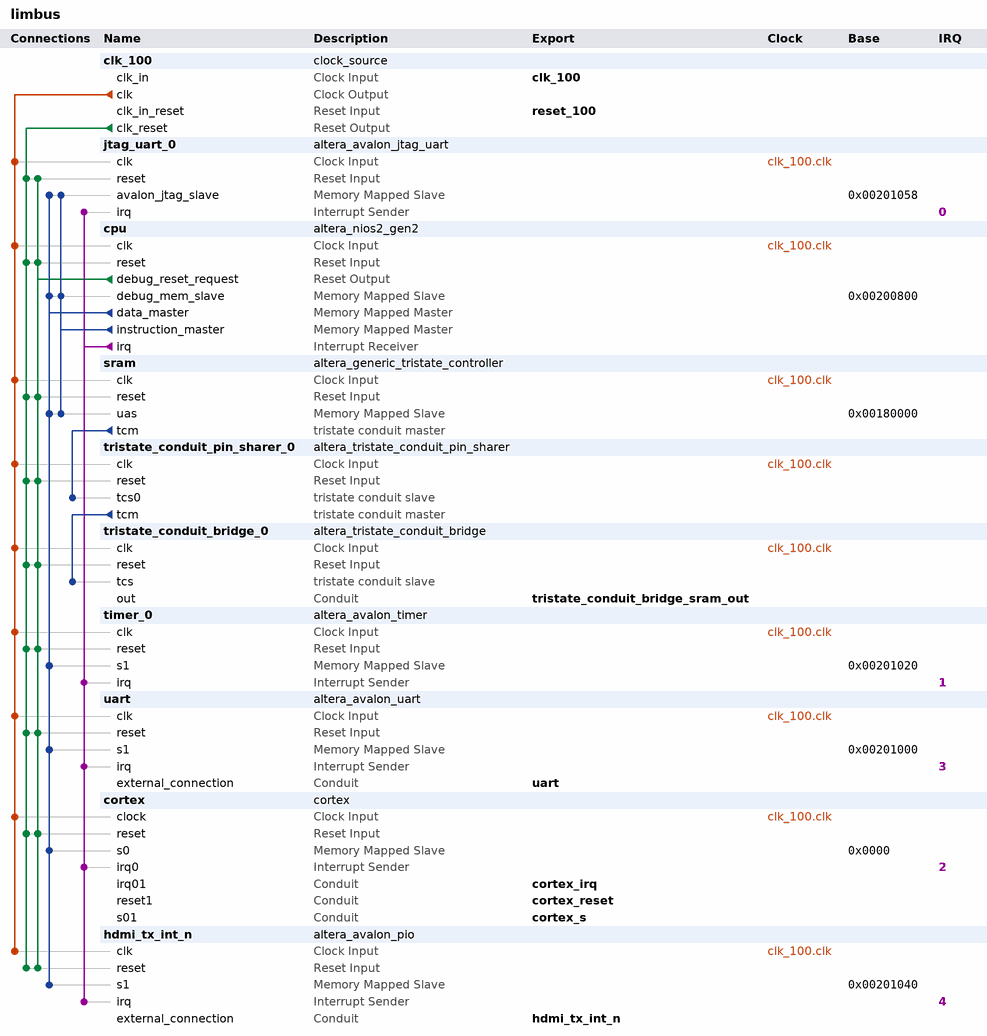
[diagram p0: system contents]
# Platform Designer (Qsys) system limbus, Cyclone V 5CGXFC5C6F27C7
# Parameters at their usual value, and those the tool derives, are not listed.
package require -exact qsys 15.1
create_system limbus
set_project_property DEVICE_FAMILY {Cyclone V}
set_project_property DEVICE 5CGXFC5C6F27C7

add_instance clk_100 clock_source 15.1
set_instance_parameter_value clk_100 clockFrequency 100000000

add_instance jtag_uart_0 altera_avalon_jtag_uart 15.1
set_instance_parameter_value jtag_uart_0 simInteractiveOptions NO_INTERACTIVE_WINDOWS

add_instance cpu altera_nios2_gen2 15.1
set_instance_parameter_value cpu dcache_size 2048
set_instance_parameter_value cpu exceptionSlave sram.uas
set_instance_parameter_value cpu icache_size 4096
set_instance_parameter_value cpu impl Tiny
set_instance_parameter_value cpu resetSlave sram.uas
set_instance_parameter_value cpu setting_activateTrace true

add_instance sram altera_generic_tristate_controller 15.1
set_instance_parameter_value sram ACTIVE_LOW_BEGINTRANSFER 0
set_instance_parameter_value sram ACTIVE_LOW_BYTEENABLE 1
set_instance_parameter_value sram ACTIVE_LOW_OUTPUTENABLE 1
set_instance_parameter_value sram ACTIVE_LOW_READ 0
set_instance_parameter_value sram CHIPSELECT_THROUGH_READLATENCY 0
set_instance_parameter_value sram INTERFACE_ASSIGNMENT_KEYS embeddedsw.configuration.isMemoryDevice
set_instance_parameter_value sram INTERFACE_ASSIGNMENT_VALUES 1
set_instance_parameter_value sram MODULE_ASSIGNMENT_KEYS embeddedsw.configuration.hwClassnameDriverSupportList,embeddedsw.CMacro.SRAM_MEMORY_SIZE,embeddedsw.CMacro.SRAM_MEMORY_UNITS,embeddedsw.CMacro.SRAM_DATA_WIDTH,embeddedsw.memoryInfo.MEM_INIT_DATA_WIDTH,embeddedsw.memoryInfo.HAS_BYTE_LANE,embeddedsw.memoryInfo.GENERATE_DAT_SYM,embeddedsw.memoryInfo.DAT_SYM_INSTALL_DIR,embeddedsw.CMacro.SIZE
set_instance_parameter_value sram MODULE_ASSIGNMENT_VALUES "altera_avalon_lan91c111\\,altera_avalon_cfi_flash,524288,1,16,16,1,1,SIM_DIR,524288"
set_instance_parameter_value sram TCM_ADDRESS_W 19
set_instance_parameter_value sram TCM_BYTEENABLE_W 2
set_instance_parameter_value sram TCM_DATA_HOLD 10
set_instance_parameter_value sram TCM_DATA_W 16
set_instance_parameter_value sram TCM_MAX_PENDING_READ_TRANSACTIONS 3
set_instance_parameter_value sram TCM_READLATENCY 2
set_instance_parameter_value sram TCM_READ_WAIT 10
set_instance_parameter_value sram TCM_SETUP_WAIT 10
set_instance_parameter_value sram TCM_SYMBOLS_PER_WORD 2
set_instance_parameter_value sram TCM_TIMING_UNITS 0
set_instance_parameter_value sram TCM_TURNAROUND_TIME 2
set_instance_parameter_value sram TCM_WRITE_WAIT 10
set_instance_parameter_value sram USE_BEGINTRANSFER 0
set_instance_parameter_value sram USE_BYTEENABLE 1
set_instance_parameter_value sram USE_OUTPUTENABLE 1
set_instance_parameter_value sram USE_READ 0

add_instance tristate_conduit_pin_sharer_0 altera_tristate_conduit_pin_sharer 15.1
set_instance_parameter_value tristate_conduit_pin_sharer_0 MODULE_ORIGIN_LIST sram.tcm,sram.tcm,sram.tcm,sram.tcm,sram.tcm,sram.tcm
set_instance_parameter_value tristate_conduit_pin_sharer_0 NUM_INTERFACES 1
set_instance_parameter_value tristate_conduit_pin_sharer_0 SIGNAL_ORIGIN_LIST address,outputenable_n,byteenable_n,write_n,data,chipselect_n

add_instance tristate_conduit_bridge_0 altera_tristate_conduit_bridge 15.1

add_instance timer_0 altera_avalon_timer 15.1
set_instance_parameter_value timer_0 period 1
set_instance_parameter_value timer_0 periodUnits MSEC

add_instance uart altera_avalon_uart 15.1
set_instance_parameter_value uart baud 115200
set_instance_parameter_value uart dataBits 8
set_instance_parameter_value uart fixedBaud true
set_instance_parameter_value uart parity NONE
set_instance_parameter_value uart stopBits 1

add_instance cortex cortex 1.0

add_instance hdmi_tx_int_n altera_avalon_pio 15.1
set_instance_parameter_value hdmi_tx_int_n bitClearingEdgeCapReg true
set_instance_parameter_value hdmi_tx_int_n captureEdge true
set_instance_parameter_value hdmi_tx_int_n direction Input
set_instance_parameter_value hdmi_tx_int_n edgeType FALLING
set_instance_parameter_value hdmi_tx_int_n generateIRQ true
set_instance_parameter_value hdmi_tx_int_n width 1

# connections
add_connection clk_100.clk cortex.clock clock
add_connection clk_100.clk cpu.clk clock
add_connection clk_100.clk hdmi_tx_int_n.clk clock
add_connection clk_100.clk jtag_uart_0.clk clock
add_connection clk_100.clk sram.clk clock
add_connection clk_100.clk timer_0.clk clock
add_connection clk_100.clk tristate_conduit_bridge_0.clk clock
add_connection clk_100.clk tristate_conduit_pin_sharer_0.clk clock
add_connection clk_100.clk uart.clk clock
add_connection clk_100.clk_reset cortex.reset reset
add_connection clk_100.clk_reset cpu.reset reset
add_connection clk_100.clk_reset hdmi_tx_int_n.reset reset
add_connection clk_100.clk_reset jtag_uart_0.reset reset
add_connection clk_100.clk_reset sram.reset reset
add_connection clk_100.clk_reset timer_0.reset reset
add_connection clk_100.clk_reset tristate_conduit_bridge_0.reset reset
add_connection clk_100.clk_reset tristate_conduit_pin_sharer_0.reset reset
add_connection clk_100.clk_reset uart.reset reset
add_connection cpu.debug_reset_request cortex.reset reset
add_connection cpu.debug_reset_request cpu.reset reset
add_connection cpu.debug_reset_request hdmi_tx_int_n.reset reset
add_connection cpu.debug_reset_request jtag_uart_0.reset reset
add_connection cpu.debug_reset_request sram.reset reset
add_connection cpu.debug_reset_request timer_0.reset reset
add_connection cpu.debug_reset_request tristate_conduit_bridge_0.reset reset
add_connection cpu.debug_reset_request tristate_conduit_pin_sharer_0.reset reset
add_connection cpu.debug_reset_request uart.reset reset
add_connection cpu.data_master cortex.s0 avalon
set_connection_parameter_value cpu.data_master/cortex.s0 baseAddress 0x0000
add_connection cpu.data_master cpu.debug_mem_slave avalon
set_connection_parameter_value cpu.data_master/cpu.debug_mem_slave baseAddress 0x00200800
add_connection cpu.data_master hdmi_tx_int_n.s1 avalon
set_connection_parameter_value cpu.data_master/hdmi_tx_int_n.s1 baseAddress 0x00201040
add_connection cpu.data_master jtag_uart_0.avalon_jtag_slave avalon
set_connection_parameter_value cpu.data_master/jtag_uart_0.avalon_jtag_slave baseAddress 0x00201058
add_connection cpu.data_master sram.uas avalon
set_connection_parameter_value cpu.data_master/sram.uas baseAddress 0x00180000
add_connection cpu.data_master timer_0.s1 avalon
set_connection_parameter_value cpu.data_master/timer_0.s1 baseAddress 0x00201020
add_connection cpu.data_master uart.s1 avalon
set_connection_parameter_value cpu.data_master/uart.s1 baseAddress 0x00201000
add_connection cpu.instruction_master cpu.debug_mem_slave avalon
set_connection_parameter_value cpu.instruction_master/cpu.debug_mem_slave baseAddress 0x00200800
add_connection cpu.instruction_master jtag_uart_0.avalon_jtag_slave avalon
set_connection_parameter_value cpu.instruction_master/jtag_uart_0.avalon_jtag_slave baseAddress 0x00201058
add_connection cpu.instruction_master sram.uas avalon
set_connection_parameter_value cpu.instruction_master/sram.uas baseAddress 0x00180000
add_connection cpu.irq cortex.irq0 interrupt
set_connection_parameter_value cpu.irq/cortex.irq0 irqNumber 2
add_connection cpu.irq hdmi_tx_int_n.irq interrupt
set_connection_parameter_value cpu.irq/hdmi_tx_int_n.irq irqNumber 4
add_connection cpu.irq jtag_uart_0.irq interrupt
set_connection_parameter_value cpu.irq/jtag_uart_0.irq irqNumber 0
add_connection cpu.irq timer_0.irq interrupt
set_connection_parameter_value cpu.irq/timer_0.irq irqNumber 1
add_connection cpu.irq uart.irq interrupt
set_connection_parameter_value cpu.irq/uart.irq irqNumber 3
add_connection sram.tcm tristate_conduit_pin_sharer_0.tcs0 tristate_conduit
add_connection tristate_conduit_pin_sharer_0.tcm tristate_conduit_bridge_0.tcs tristate_conduit

# exported interfaces
add_interface clk_100 clock sink
set_interface_property clk_100 EXPORT_OF clk_100.clk_in
add_interface cortex_irq conduit end
set_interface_property cortex_irq EXPORT_OF cortex.irq01
add_interface cortex_reset conduit end
set_interface_property cortex_reset EXPORT_OF cortex.reset1
add_interface cortex_s conduit end
set_interface_property cortex_s EXPORT_OF cortex.s01
add_interface hdmi_tx_int_n conduit end
set_interface_property hdmi_tx_int_n EXPORT_OF hdmi_tx_int_n.external_connection
add_interface reset_100 reset sink
set_interface_property reset_100 EXPORT_OF clk_100.clk_in_reset
add_interface tristate_conduit_bridge_sram_out conduit end
set_interface_property tristate_conduit_bridge_sram_out EXPORT_OF tristate_conduit_bridge_0.out
add_interface uart conduit end
set_interface_property uart EXPORT_OF uart.external_connection

set_interconnect_requirement {$system} qsys_mm.clockCrossingAdapter HANDSHAKE
set_interconnect_requirement {$system} qsys_mm.insertDefaultSlave false
set_interconnect_requirement {$system} qsys_mm.maxAdditionalLatency 1

save_system limbus.qsys
